# EAGLE design radio_fm_cd2003_tda2822 (EAGLE 9.6.2)
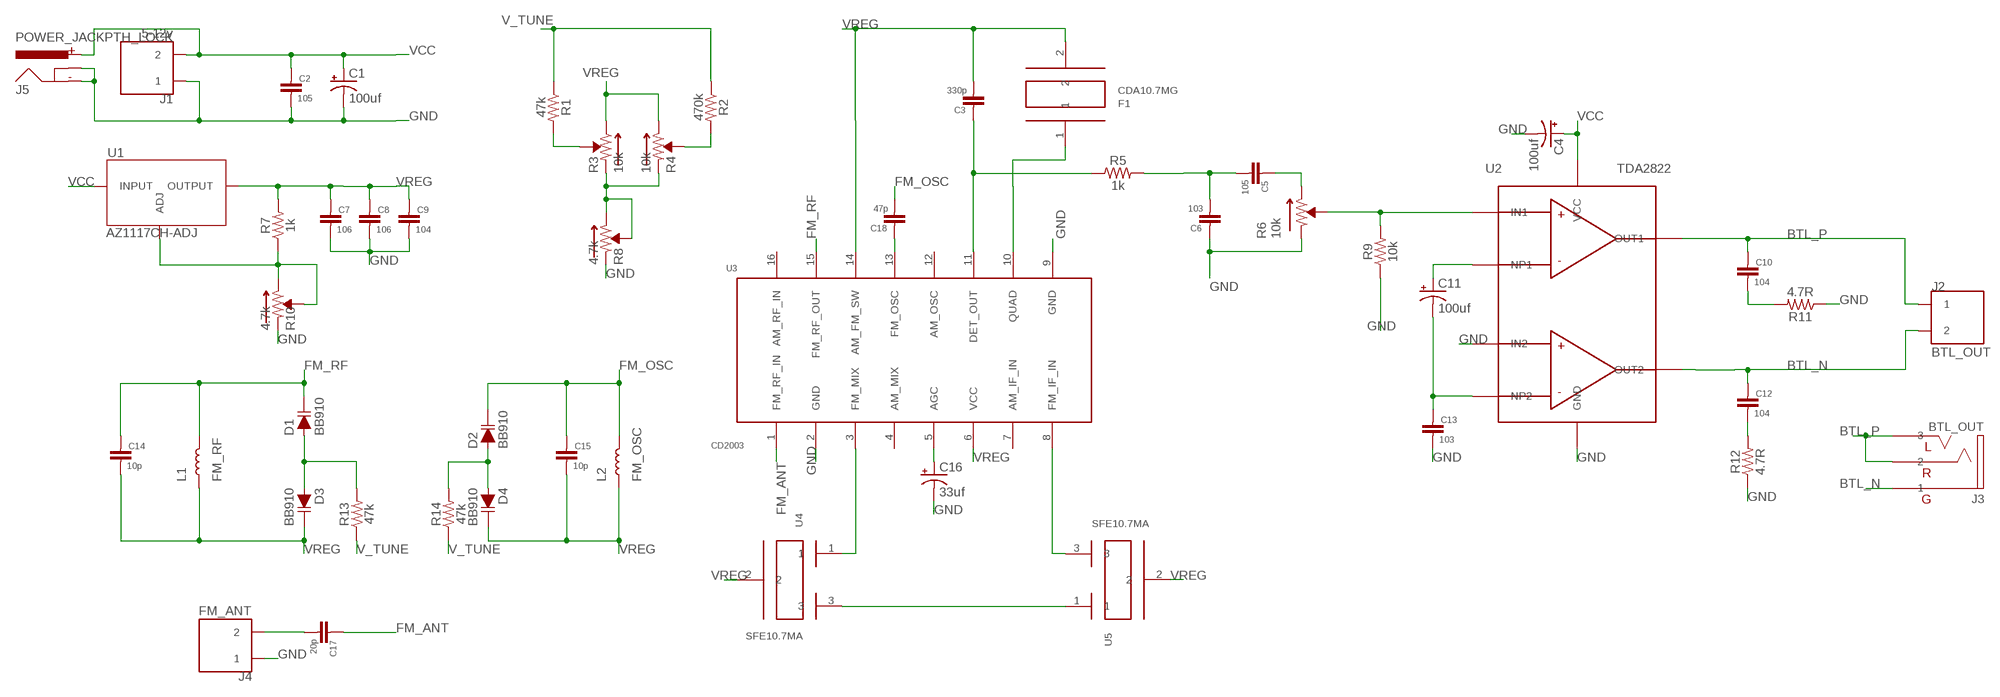
[diagram p0: schematic, sheet 1]

## Parts
C1  100uf  CAP  [CAP_2.5MM]
C2  105  CAP_SMDC0603  [C0603]
C3  330p  CAP_SMDC0603  [C0603]
C4  100uf  CAP  [CAP_2.5MM]
C5  105  CAP_SMDC0603  [C0603]
C6  103  CAP_SMDC0603  [C0603]
C7  106  CAP_SMDC0603  [C0603]
C8  106  CAP_SMDC0603  [C0603]
C9  104  CAP_SMDC0603  [C0603]
C10  104  CAP_SMDC0603  [C0603]
C11  100uf  CAP  [CAP_2.5MM]
C12  104  CAP_SMDC0603  [C0603]
C13  103  CAP_SMDC0603  [C0603]
C14  10p  CAP_SMDC0603  [C0603]
C15  10p  CAP_SMDC0603  [C0603]
C16  33uf  CAP2MM  [CAP_2MM]
C17  20p  CAP_SMDC0603  [C0603]
C18  47p  CAP_SMDC0603  [C0603]
D1  BB910  VARIODE-TO92S  [TO-92S]
D2  BB910  VARIODE-TO92S  [TO-92S]
D3  BB910  VARIODE-TO92S  [TO-92S]
D4  BB910  VARIODE-TO92S  [TO-92S]
F1  CDA10.7MG  [CDA10.7MG]
J1  5-12v  2P  [2P_2.54MM]
J2  BTL_OUT  2P5.0  [2P_5.08MM]
J3  BTL_OUT  3.5MM_PHONE  [3.5MM]
J4  FM_ANT  2P  [2P_2.54MM]
J5  POWER_JACKPTH_LOCK  [POWER_JACK_PTH_LOCK]
L1  FM_RF  INDUCTOR_PTH  [VLU0810]
L2  FM_OSC  INDUCTOR_PTH  [VLU0810]
R1  47k  RESISTOR_SMDR0603  [R0603]
R2  470k  RESISTOR_SMDR0603  [R0603]
R3  10k  RES_ADJ  [3362P]
R4  10k  RES_ADJ  [3362P]
R5  1k  RESISTOR_SMDR0603  [R0603]
R6  10k  RES_ADJ  [3362P]
R7  1k  RESISTOR_SMDR0603  [R0603]
R8  4.7k  RES_ADJ  [3362P]
R9  10k  RESISTOR_SMDR0603  [R0603]
R10  4.7k  RES_ADJ  [3362P]
R11  4.7R  RESISTOR_SMDR0603  [R0603]
R12  4.7R  RESISTOR_SMDR0603  [R0603]
R13  47k  RESISTOR_SMDR0603  [R0603]
R14  47k  RESISTOR_SMDR0603  [R0603]
U1  AZ1117CH-ADJ  [SOT-223]
U2  TDA2822  TDA2822-DIP8  [DIP8]
U3  CD2003  TA2003  [DIP16]
U4  SFE10.7MA  [SFE10.7MA]
U5  SFE10.7MA  [SFE10.7MA]

## Nets
BTL_N: C12.1 J2.N J3.P$1 U2.P$3(OUT2)
BTL_P: C10.1 J2.L J3.P$2 J3.P$3 U2.P$1(OUT1)
FM_ANT: C17.1 U3.1(FM_RF_IN)
FM_OSC: C15.1 C18.2 D2.2(C) L2.-
FM_RF: C14.1 D1.2(C) L1.- U3.15(FM_RF_OUT)
GND: C1.- C2.2 C4.- C6.1 C7.2 C8.2 C9.2 C13.2 C16.- J1.1 J4.1 J5.GND J5.GNDBREAK R6.P$1 R8.P$1 R9.1 R10.P$1 R11.1 R12.1 U2.P$4(GND) U2.P$6(IN2) U3.2(GND) U3.9(GND)
N$1: C11.+ U2.P$8(NP1)
N$2: C12.2 R12.2
N$3: C11.- C13.1 U2.P$5(NP2)
N$4: C5.1 R6.P$3
N$5: C3.1 R5.1 U3.11(DET_OUT)
N$6: D1.1(A) D3.1(A) R13.2
N$7: C16.+ U3.5(AGC)
N$8: R7.1 R10.P$2 R10.P$3 U1.1(ADJ)
N$9: D2.1(A) D4.1(A) R14.2
N$10: U3.3(FM_MIX) U4.1
N$11: U3.8(FM_IF_IN) U5.3
N$12: R1.2 R3.P$2
N$13: U4.3 U5.1
N$14: F1.1 U3.10(QUAD)
N$15: C10.2 R11.2
N$16: C17.2 J4.2
N$17: C5.2 C6.2 R5.2
N$18: C18.1 U3.13(FM_OSC)
N$19: R3.P$1 R4.P$1 R8.P$2 R8.P$3
N$22: R6.P$2 R9.2 U2.P$7(IN1)
N$23: R2.2 R4.P$2
V_TUNE: R1.1 R2.1 R13.1 R14.1
VCC: C1.+ C2.1 C4.+ J1.2 J5.PWR U1.3(INPUT) U2.P$2(VCC)
VREG: C3.2 C7.1 C8.1 C9.1 C14.2 C15.2 D3.2(C) D4.2(C) F1.2 L1.+ L2.+ R3.P$3 R4.P$3 R7.2 U1.2(OUTPUT) U3.6(VCC) U3.14(AM_FM_SW) U4.2 U5.2
Unconnected: U3.4(AM_MIX) U3.7(AM_IF_IN) U3.12(AM_OSC) U3.16(AM_RF_IN)

## Library data of the parts
C1 C4 C11 C16 = Capacitors:CAP
C2 C3 C5-C10 C12-C15 C17 C18 = Capacitors:CAP_SMD
D1-D4 = PTH:VARIODE: Diode These are standard reverse protection diodes and small signal diodes. SparkFun Products: SparkFun SparkPunk Sound Kit <https://www.sparkfun.com/products/11177> SparkFun ESP8266 Thing <https://www.sparkfun.com/products/13231>
F1 = PTH:CDA10.7MG
J1 J2 J4 = Jumpers:2P
J3 = Connectors:3.5MM_PHONE: 描述： 类型：3.5mm耳机插口 接口：三段式 连接：https://item.szlcsc.com/19296.html
J5 = Connectors:POWER_JACK: Power Jack Connector This is the standard 5.5mm barrel jack for power. The PTH is the most common, proven, reliable, footprint. The Slot footprint only works if the mill layer is transmitted to the PCB fab house so be warned. Here are the connectors we sell at SparkFun: DC Barrel Power Jack/Connector <https://www.sparkfun.com/products/119> (PRT-00119) DC Barrel Power Jack/Connector (SMD) <https://www.sparkfun.com/products/12748> (PRT-12748) DC Barrel Jack Adapter - Breadboard Compatible <https://www.sparkfun.com/products/10811> (PRT-10811) It is used on this SparkFun product (and many, many others): SparkFun RedBoard - Programmed with Arduino <https://www.sparkfun.com/products/12757> (DEV-12757) Also, if you need a mating power supply or connector, please check these out: Wall Adapter Power Supply - 9VDC 650mA <https://www.sparkfun.com/products/298> (TOL-00298) DC Barrel Jack Adapter - Male <https://www.sparkfun.com/products/10287> (PRT-10287); PROD_ID: CONN-08197; SF_ID: PRT-00119
L1 L2 = Coils:INDUCTOR_PTH: 描述： 名称：电感 VLU0810-102K 参数：1000uH ±10% 封装：8*10 链接：https://item.szlcsc.com/73738.html
R1 R2 R5 R7 R9 R11-R14 = Resistors:RESISTOR_SMD
R3 R4 R6 R8 R10 = Resistors:RES_ADJ: 描述：可调电阻器 链接：https://item.szlcsc.com/120225.html
U1 = IC_Power:AZ1117CH-ADJ: 描述： 类型：可调节电源芯片 型号：AZ1117CH-ADJ 输入电压：15v（max） 封装：sot223（注意AZ1117CH和AZ1117CH2的引脚顺序区别） 链接：https://item.szlcsc.com/96602.html
U2 = IC-Amplifiers:TDA2822
U3 = IC_Comms:TA2003
U4 U5 = PTH:SFE10.7MA

## Board
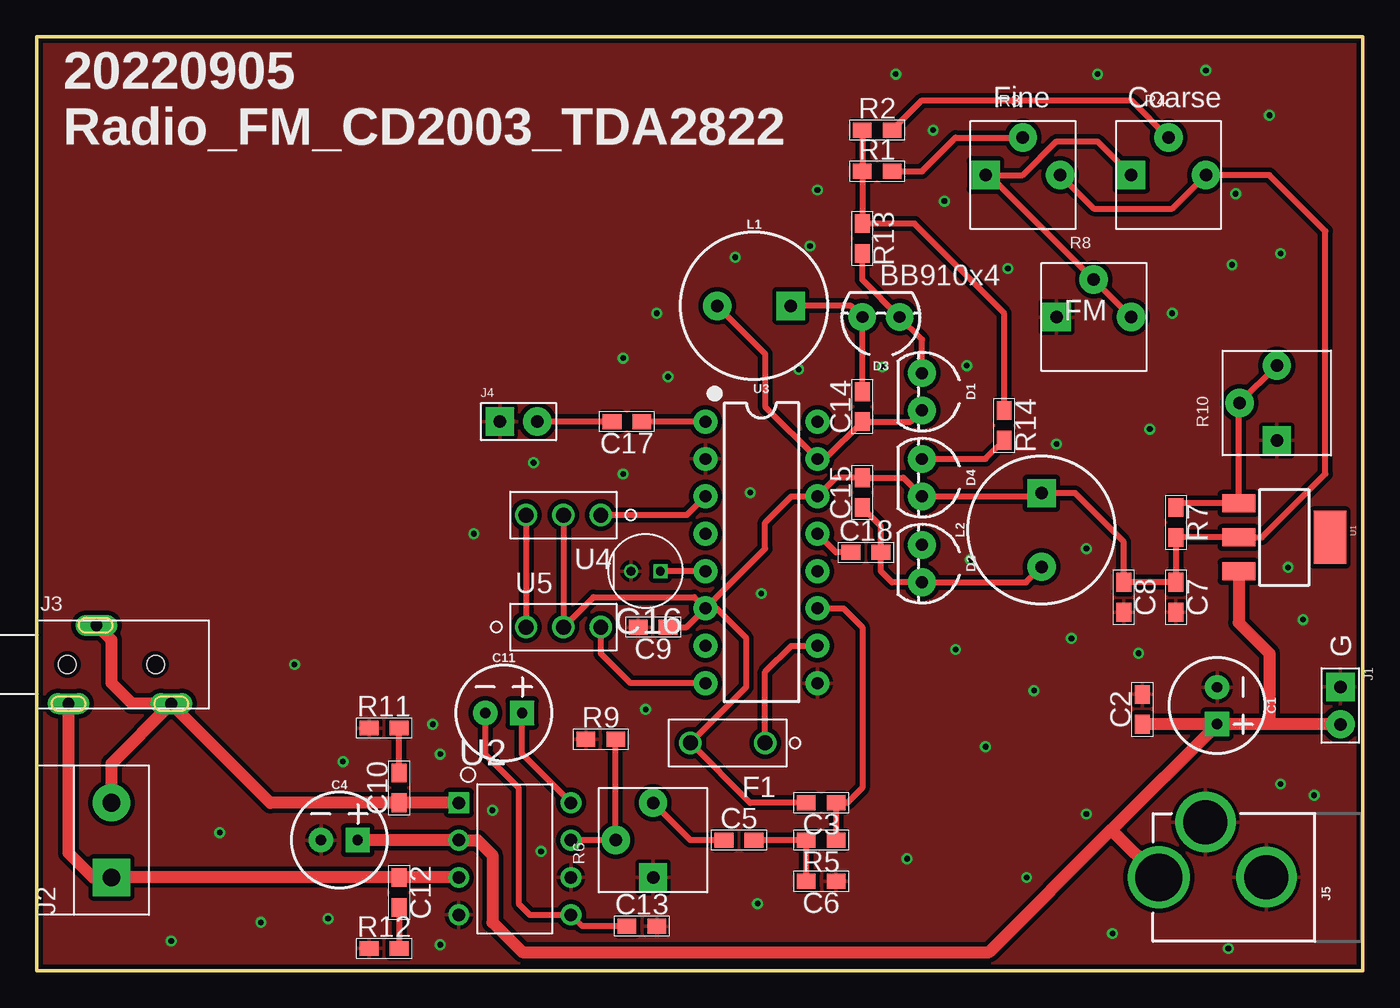
[diagram p1: board, top side]
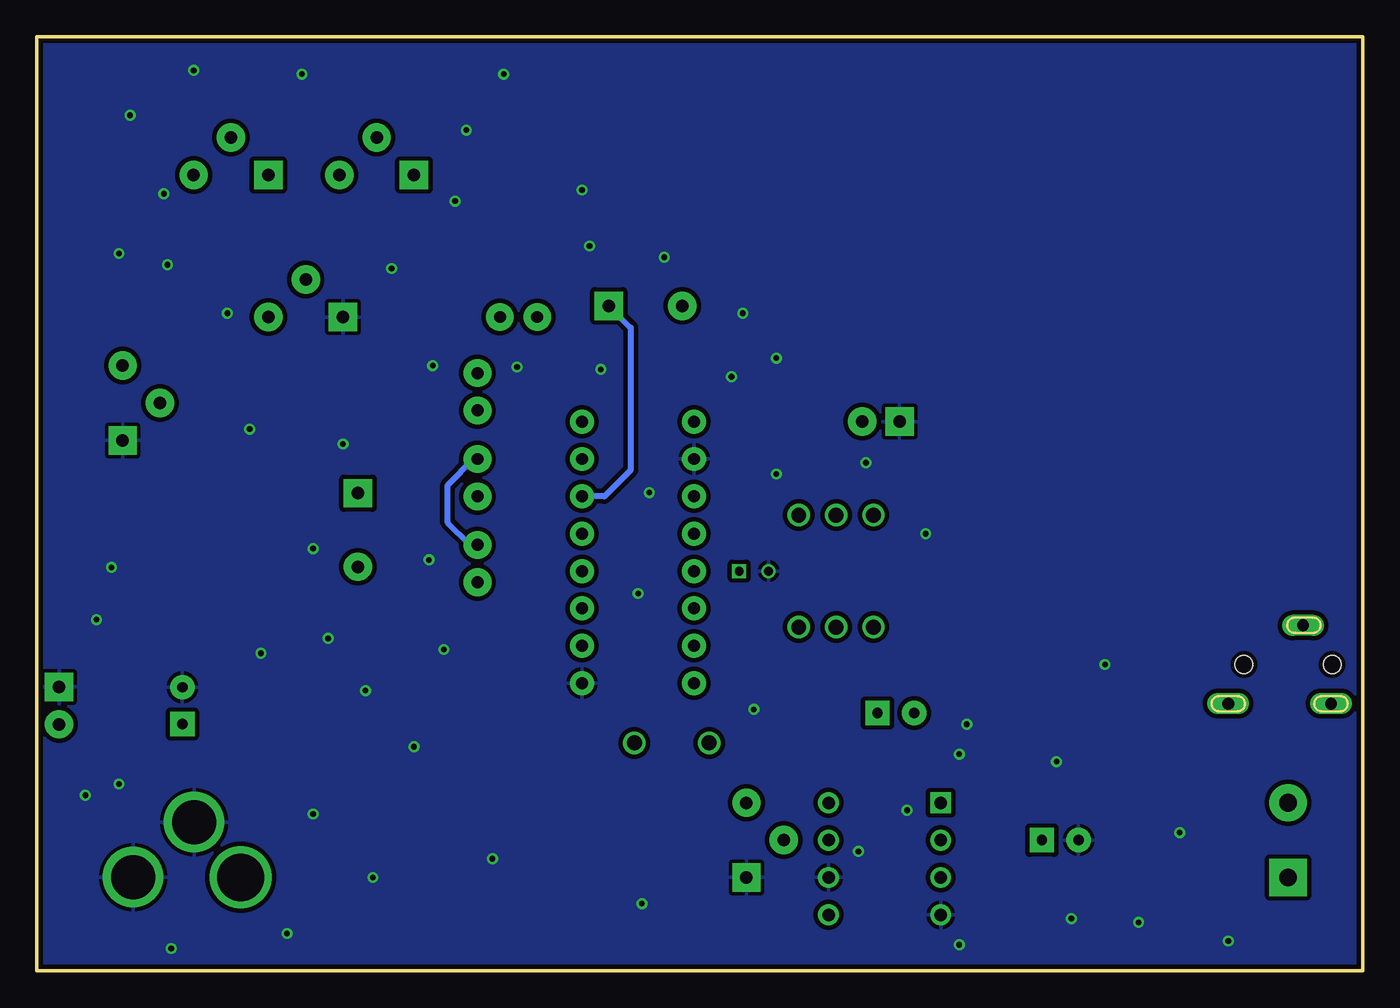
[diagram p2: board, bottom side, seen from below]

Size 90.17 x 63.5 mm. Coordinates in mm from the lower left corner, seen from the top.
Outline: 0,0 0,63.5 90.17,63.5 90.17,0 0,0
Copper layers (1*16): Top 0.035mm / dielectric 1.5mm / Bottom 0.035mm
Design rules "SparkFun-2-Layer-General-JLCPCB": minimum track width 7mil, minimum drill 0.3mm, track to track 7mil, track to pad 7mil, pad to pad 7mil, via to via 7mil, smd to smd 7mil, copper to edge 7mil, drill to drill 7mil, minimum pad ring 7mil, minimum via ring 7mil, stop-mask expansion 3mil, vias tented up to drill 25mil, thermal gap 10mil

### Footprints (pad centres in the part's own frame; a part is rotated, then mirrored left to right if it is on the bottom)
CAP_2.5MM = drill 0.7 pad 1.651 square: + 1.25,0 | drill 0.7 pad 1.651: - -1.25,0
C0603 = smd 1.27 x 1.016: 1 -1.016,0; 2 1.016,0
CAP_2MM = drill 0.6 square: + -1,0 | drill 0.6: - 1,0
TO-92S = drill 0.813 pad 1.88: 1 -1.27,0; 2 1.27,0
CDA10.7MG = drill 1.016: 1 -2.54,0; 2 2.54,0
2P_2.54MM = drill 0.85 pad 1.93 square: 1 0,0 | drill 0.85 pad 1.93: 2 2.54,0
2P_5.08MM = drill 1.2 pad 2.54: L 5.08,0 | drill 1.2 pad 2.54 square: N 0,0
3.5MM = drill 0.8 pad 1.422 long: P$1 -2.921,-2.667; P$2 -1.016,2.667; P$3 4.064,-2.667 | hole 1.2: -3,0; 3,0
POWER_JACK_PTH_LOCK = drill 2.997 pad 4.115: GND 0.025,6.557; GNDBREAK 3.762,10.7 | drill 3.2 pad 4.115: PWR 0,13.878
VLU0810 = drill 0.85 pad 1.93 square: + 2.5,0 | drill 0.85 pad 1.93: - -2.5,0
R0603 = smd 1.27 x 1.016: 1 -1.016,0; 2 1.016,0
3362P = drill 0.85 pad 1.93 square: P$1 -2.54,0 | drill 0.85 pad 1.93: P$2 0,2.54; P$3 2.54,0
SOT-223 = smd 2.235 x 1.219: 1 3.099,-2.311; 2 3.099,0; 3 3.099,2.311 | smd 2.2 x 3.6: 4 -3.099,0
DIP8 = drill 0.85 pad 1.422 square: P$1 -3.81,3.81 | drill 0.85 pad 1.422: P$2 -3.81,1.27; P$3 -3.81,-1.27; P$4 -3.81,-3.81; P$5 3.81,-3.81; P$6 3.81,-1.27; P$7 3.81,1.27; P$8 3.81,3.81
DIP16 = drill 0.813 pad 1.626: 1 -8.89,-3.81; 2 -6.35,-3.81; 3 -3.81,-3.81; 4 -1.27,-3.81; 5 1.27,-3.81; 6 3.81,-3.81; 7 6.35,-3.81; 8 8.89,-3.81; 9 8.89,3.81; 10 6.35,3.81; 11 3.81,3.81; 12 1.27,3.81; 13 -1.27,3.81; 14 -3.81,3.81; 15 -6.35,3.81; 16 -8.89,3.81
SFE10.7MA = drill 1.016: 1 -2.54,0; 2 0,0; 3 2.54,0

### Placement (x,y rotation side)
C1  80.26,18.03 270 top
C2  75.18,17.78 90 top
C3  53.34,11.43 180 top
C4  20.57,8.89 0 top
C5  47.75,8.89 0 top
C6  53.34,6.1 180 top
C7  77.47,25.4 270 top
C8  73.91,25.4 270 top
C9  41.91,23.37 180 top
C10  24.64,12.45 90 top
C11  31.75,17.53 0 top
C12  24.64,5.33 270 top
C13  41.15,3.05 0 top
C14  56.13,38.35 90 top
C15  56.13,32.51 90 top
C16  41.4,27.18 180 top
C17  40.13,37.34 180 top
C18  56.39,28.45 0 top
D1  60.2,39.37 270 top
D2  60.2,27.69 270 top
D3  57.4,44.45 180 top
D4  60.2,33.53 270 top
F1  46.99,15.49 180 top
J1  88.65,19.3 270 top
J2  5.08,6.35 90 top
J3  5.08,20.83 0 top
J4  31.5,37.34 0 top
J5  90.17,6.35 90 top
L1  48.77,45.21 0 top
L2  68.33,29.97 90 top
R1  57.15,54.36 0 top
R2  57.15,57.15 0 top
R3  67.06,54.1 0 top
R4  76.96,54.1 0 top
R5  53.34,8.89 180 top
R6  41.91,8.89 90 top
R7  77.47,30.48 270 top
R8  71.88,44.45 0 top
R9  38.35,15.75 0 top
R10  84.33,38.61 90 top
R11  23.62,16.51 0 top
R12  23.62,1.52 0 top
R13  56.13,49.78 270 top
R14  65.79,37.08 270 top
U1  84.84,29.46 180 top
U2  32.51,7.62 0 top
U3  49.28,28.45 270 top
U4  35.81,30.99 180 top
U5  35.81,23.37 0 top

### Tracks (layer width: path | path; a pad name or v marks a point on that pad's centre or on a via)
BTL_N
  Top 0.813: J3.P$1 2.16,8 3.81,6.35 J2.N C12.1 U2.P$3
BTL_P
  Top 0.813: U2.P$1 C10.1 15.88,11.43 J3.P$3 | J3.P$3 6.48,18.16 5.08,19.56 5.08,22.48 J3.P$2 | J2.L 5.08,14.1 J3.P$3
FM_ANT
  Top 0.406: U3.1 C17.1
FM_OSC
  Top 0.406: L2.- 67.27,26.42 D2.2 58.17,26.42 57.4,27.18 C18.2 57.4,30.23 C15.1
FM_RF
  Top 0.406: L1.- 49.53,41.95 49.53,38.35 U3.15 53.59,34.8 C14.1 59.44,37.34 D1.2
GND  (via drill 0.38)
  other vias: 84.58,48.77 67.31,6.35 67.82,19.05 70.36,22.61 51.82,40.89 42.16,44.7 52.58,49.28 81.53,52.83 64.52,15.24 33.78,34.54 81.28,48.01 84.58,12.7 49.02,4.57 59.18,7.62 27.43,1.78 30.99,10.92 34.29,8.13 41.4,17.78 26.92,16.76 17.53,20.83 12.45,9.4 29.72,29.72 39.88,33.78 48.51,32.51 49.28,25.65 42.93,40.39 62.48,21.84 63.5,27.94 69.34,35.81 63.25,41.15 66.04,47.75 61.72,52.32 53.09,53.09 47.5,48.51 39.88,41.66 71.37,28.7 77.22,44.7 83.82,58.17 60.96,57.15 58.42,60.96 72.14,60.96 79.5,61.21 75.69,36.83 85.09,27.43 86.11,23.88 86.87,11.94 73.15,2.54 81.03,1.52 71.37,10.67 74.93,21.59 15.24,3.3 9.14,2.03 19.81,3.56 20.83,14.22 27.43,14.73 57.51,41.05
  pour Bottom (isolate 0.305): 0,0 0,63.5 90.17,63.5 90.17,0
  pour Top (isolate 0.305): 0,0 0,63.5 90.17,63.5 90.17,0
N$1
  Top 0.406: U2.P$8 33,14.75 C11.+
N$2
  Top 0.406: C12.2 R12.2
N$3
  Top 0.406: C11.- 30.5,14.71 32.77,12.45 32.77,4.57 33.53,3.81 U2.P$5 37.08,3.05 C13.1
N$4
  Top 0.406: C5.1 44.45,8.89 R6.P$3
N$5
  Top 0.406: U3.11 54.86,24.64 56.13,23.37 56.13,12.45 55.12,11.43 C3.1 R5.1
N$6
  Top 0.406: D1.1 60.2,42.93 D3.1 56.13,46.99 R13.2
N$7
  Top 0.406: U3.5 C16.+
N$8
  Top 0.406: R7.1 77.75,31.77 U1.1 81.74,38.56 R10.P$2 R10.P$3
N$9
  Top 0.406: D4.1 64.52,34.8 R14.2
  Bottom 0.406: D2.1 60.71,28.96 62.23,30.48 62.23,33.02 60.45,34.8 D4.1
N$10
  Top 0.406: U3.3 44.2,30.99 U4.1
N$11
  Top 0.406: U3.8 40.39,19.56 38.35,21.59 U5.3
N$12
  Top 0.406: R1.2 60.2,54.36 62.48,56.64 R3.P$2
N$13
  Top 0.406: U4.3 U5.1
N$14
  Top 0.406: F1.1 49.53,20.32 51.31,22.1 U3.10
N$15
  Top 0.406: C10.2 R11.2
N$16
  Top 0.406: C17.2 J4.2
N$17
  Top 0.406: C5.2 R5.2 C6.2
N$18
  Top 0.406: C18.1 54.36,28.45 U3.13
N$19
  Top 0.406: R4.P$1 72.14,56.39 69.34,56.39 67.06,54.1 R3.P$1 64.77,54.1 R8.P$2 R8.P$3
N$22
  Top 0.406: R9.2 R6.P$2 U2.P$7
N$23
  Top 0.406: R2.2 60.2,59.18 74.42,59.18 R4.P$2
V_TUNE
  Top 0.406: R2.1 R1.1 R13.1 59.69,50.8 65.79,44.7 R14.1
VCC
  Top 0.813: 73.15,9.65 64.77,1.27 33.02,1.27 30.99,3.3 30.99,7.87 29.97,8.89 U2.P$2 C4.+ | 73.15,9.65 80.26,16.76 C1.+ | 75.2,16.78 C2.1 75.2,16.78 | 83.82,16.78 88.63,16.78 J1.2 | U1.3 81.74,23.67 83.82,21.59 83.82,16.78 | 75.2,16.78 C1.+ | C1.+ 83.82,16.78 | J5.PWR 73.15,9.49 73.15,9.65
VREG
  Top 0.406: C3.2 48.51,11.43 F1.2 48.26,19.3 48.26,22.61 46.23,24.64 U3.6 | U3.6 49.53,28.7 49.53,30.48 51.31,32.26 U3.14 54.36,33.53 C15.2 58.93,33.53 D4.2 68.03,32.26 68.29,32.51 L2.+ 70.61,32.47 73.91,29.17 C8.1 C7.1 R7.2 U1.2 83.31,29.46 87.63,33.78 87.63,50.29 83.82,54.1 R4.P$3 77.22,51.82 71.88,51.82 R3.P$3 | U3.6 44.7,25.4 37.85,25.4 U5.2 U4.2 | C9.1 44.2,23.37 U3.6 | C14.2 D3.2 55.37,45.21 L1.+
  Bottom 0.406: L1.+ 49.78,43.73 49.78,34.04 51.56,32.26 U3.14

### Text on the board
tPlace: 20220905 | Fine | Coarse | Radio_FM_CD2003_TDA2822 | BB910x4 | FM | G